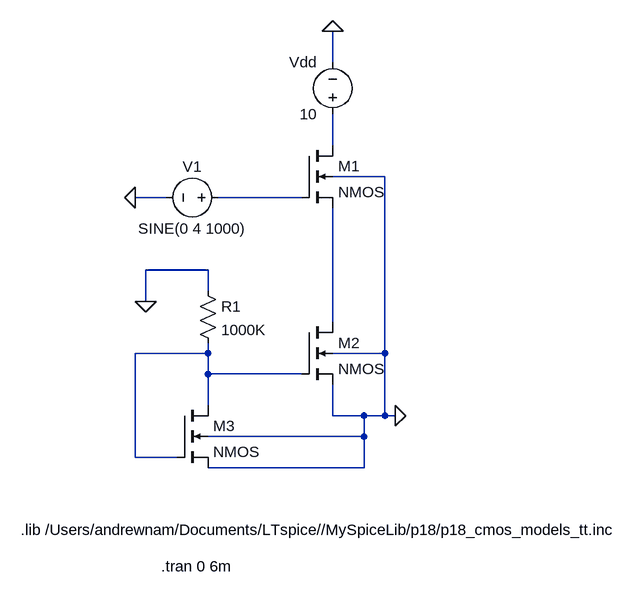
[diagram p0: schematic fig09_sourcefollower.asc]
fig09_sourcefollower.asc, the LTspice schematic file:
Version 4
SHEET 1 936 748
WIRE 464 -64 464 -112
WIRE 464 64 464 16
WIRE 544 112 464 112
WIRE 208 144 160 144
WIRE 416 144 288 144
WIRE 272 256 176 256
WIRE 272 288 272 256
WIRE 176 304 176 256
WIRE 464 336 464 160
WIRE 272 384 272 368
WIRE 272 384 160 384
WIRE 544 384 544 112
WIRE 544 384 464 384
WIRE 272 416 272 384
WIRE 416 416 272 416
WIRE 272 464 272 416
WIRE 464 480 464 432
WIRE 512 480 464 480
WIRE 544 480 544 384
WIRE 544 480 512 480
WIRE 560 480 544 480
WIRE 512 512 512 480
WIRE 512 512 272 512
WIRE 160 544 160 384
WIRE 224 544 160 544
WIRE 512 560 512 512
WIRE 512 560 272 560
FLAG 464 -112 0
FLAG 160 144 0
FLAG 560 480 0
FLAG 176 304 0
SYMBOL voltage 304 144 R90
WINDOW 0 -32 56 VBottom 2
WINDOW 3 32 56 VTop 2
SYMATTR InstName V1
SYMATTR Value SINE(0 4 1000)
SYMBOL voltage 464 32 R180
WINDOW 0 24 96 Left 2
WINDOW 3 24 16 Left 2
SYMATTR InstName Vdd
SYMATTR Value 10
SYMBOL nmos4 416 64 R0
SYMATTR InstName M1
SYMATTR Value2 l=0.18u w=10u
SYMBOL nmos4 416 336 R0
SYMATTR InstName M2
SYMATTR Value2 l=0.18u w=10u
SYMBOL nmos4 224 464 R0
SYMATTR InstName M3
SYMATTR Value2 l=0.18u w=10u
SYMBOL res 256 272 R0
SYMATTR InstName R1
SYMATTR Value 1000K
TEXT -16 656 Left 2 !.lib /Users/andrewnam/Documents/LTspice//MySpiceLib/p18/p18_cmos_models_tt.inc
TEXT 200 712 Left 2 !.tran 0 6m

The netlist it stands for:
* fig09_sourcefollower.asc
V1 N002 0 SINE(0 4 1000)
Vdd N001 0 10
M1 N001 N002 N003 0 NMOS l=0.18u w=10u
M2 N003 N004 0 0 NMOS l=0.18u w=10u
M3 N004 N004 0 0 NMOS l=0.18u w=10u
R1 0 N004 1000K
.model NMOS NMOS
.model PMOS PMOS
.lib standard.mos
.lib /Users/andrewnam/Documents/LTspice//MySpiceLib/p18/p18_cmos_models_tt.inc
.tran 0 6m
.backanno
.end